# Altium schematic sheet 100_TOP_LEVEL.SchDoc
size A4; SheetNumber: 1; SheetTotal: 2
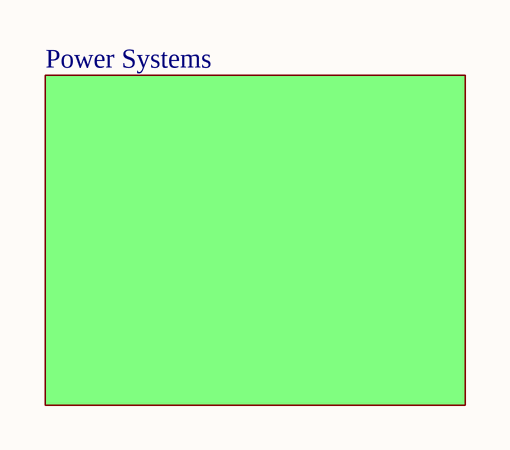
[diagram p0: 100_TOP_LEVEL.SchDoc]

## Sub-sheets
Power Systems = 02_POWER_SYSTEMS: no entries